# Altium schematic sheet PP1_PIC32.SchDoc
size 250 x 199 mm
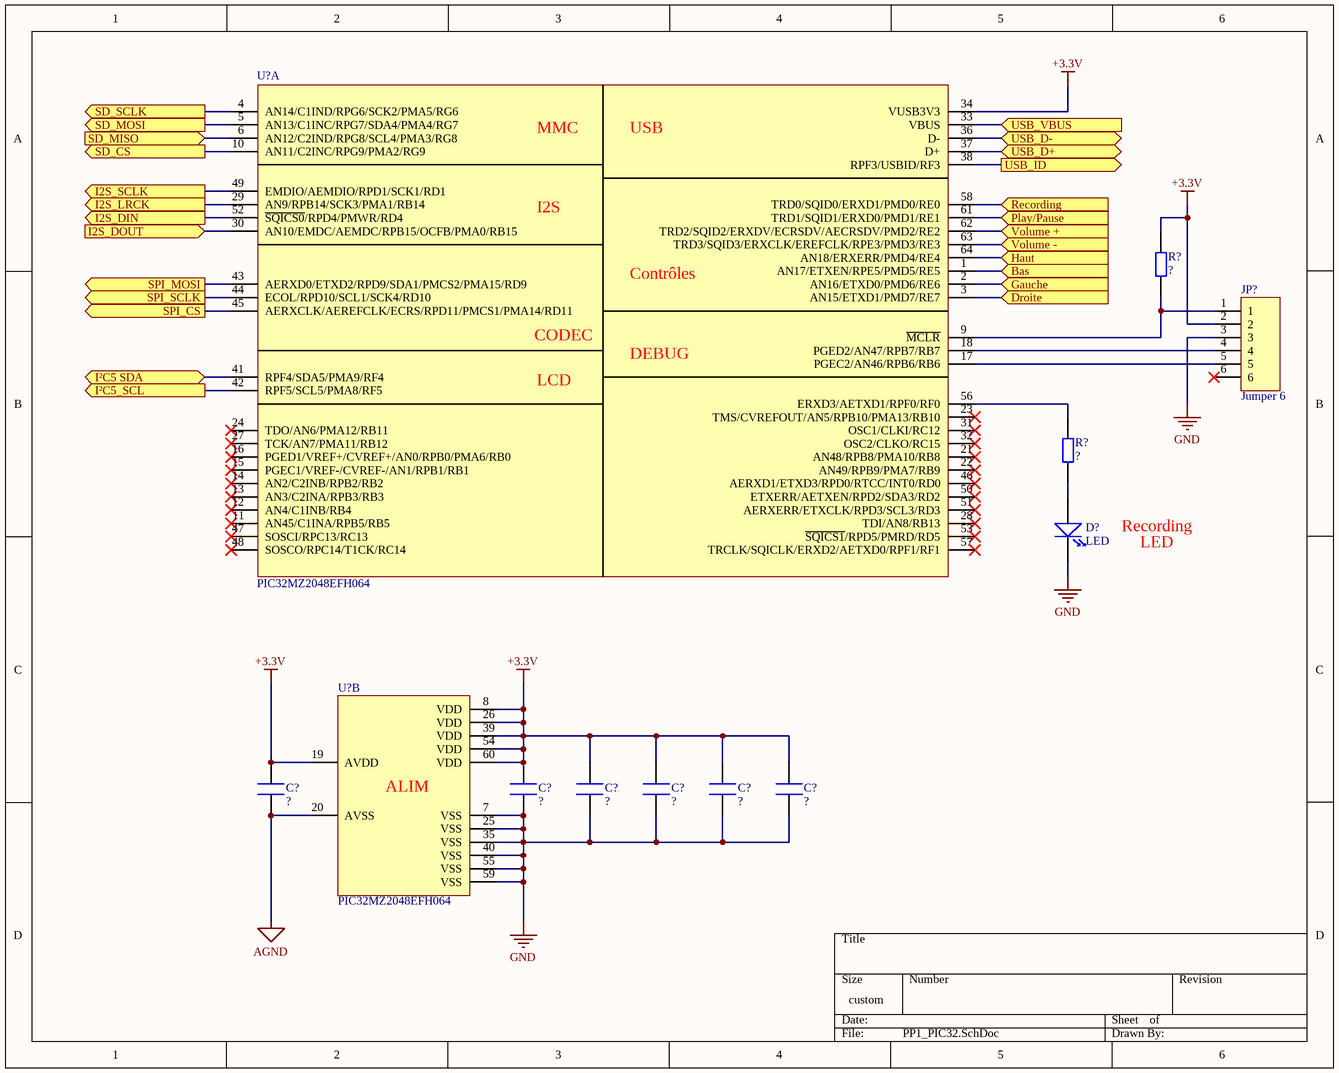
[diagram p0: PP1_PIC32.SchDoc]

## Parts
(Parts that share a designator on the sheet are numbered #1, #2 ... from top to bottom, then left to right.)
C?#1  Condo  (value not drawn)  (no BOM)
C?#2  Condo  (value not drawn)  (no BOM)
C?#3  Condo  (value not drawn)  (no BOM)
C?#4  Condo  (value not drawn)  (no BOM)
C?#5  Condo  (value not drawn)  (no BOM)
C?#6  Condo  (value not drawn)  (no BOM)
D?  LED  (no BOM)
JP?  Jumper 6  (no BOM)
R?#1  Res  (value not drawn)  (no BOM)
R?#2  Res  (value not drawn)  (no BOM)
U?#1  PIC32MZ2048EFH064  (part A of 2)
U?#2  PIC32MZ2048EFH064  (part B of 2)

## Ports
Bas (in), Droite (in), Gauche (in), Haut (in), I2S_DIN (out), I2S_DOUT (in), I2S_LRCK (out), I2S_SCLK (out), I²C5 SDA (bidir), I²C5_SCL (out), Play/Pause (in), Recording (in), SD_CS (out), SD_MISO (in), SD_MOSI (out), SD_SCLK (out), SPI_CS (out), SPI_MOSI (out), SPI_SCLK (out), USB_D+ (bidir), USB_D- (bidir), USB_ID (out), USB_VBUS (in), Volume + (in), Volume - (in)

## Nets
+3.3V: C?#1.2 C?#2.2 C?#3.2 C?#4.2 C?#5.2 C?#6.2 JP?.2 R?#1.1 U?#1.34(VUSB3V3) U?#2.8(VDD) U?#2.19(AVDD) U?#2.26(VDD) U?#2.39(VDD) U?#2.54(VDD) U?#2.60(VDD)
AGND: C?#1.1 U?#2.20(AVSS)
GND: C?#2.1 C?#3.1 C?#4.1 C?#5.1 C?#6.1 D?.2(-) JP?.3 U?#2.7(VSS) U?#2.25(VSS) U?#2.35(VSS) U?#2.40(VSS) U?#2.55(VSS) U?#2.59(VSS)
Bas: U?#1.1(AN17/ETXEN/RPE5/PMD5/RE5) ; port Bas
Droite: U?#1.3(AN15/ETXD1/PMD7/RE7) ; port Droite
Gauche: U?#1.2(AN16/ETXD0/PMD6/RE6) ; port Gauche
Haut: U?#1.64(AN18/ERXERR/PMD4/RE4) ; port Haut
I2S_DIN: U?#1.52(~{SQICS0}/RPD4/PMWR/RD4) ; port I2S_DIN
I2S_DOUT: U?#1.30(AN10/EMDC/AEMDC/RPB15/OCFB/PMA0/RB15) ; port I2S_DOUT
I2S_LRCK: U?#1.29(AN9/RPB14/SCK3/PMA1/RB14) ; port I2S_LRCK
I2S_SCLK: U?#1.49(EMDIO/AEMDIO/RPD1/SCK1/RD1) ; port I2S_SCLK
I²C5 SDA: U?#1.41(RPF4/SDA5/PMA9/RF4) ; port I²C5 SDA
I²C5_SCL: U?#1.42(RPF5/SCL5/PMA8/RF5) ; port I²C5_SCL
Play/Pause: U?#1.61(TRD1/SQID1/ERXD0/PMD1/RE1) ; port Play/Pause
Recording: U?#1.58(TRD0/SQID0/ERXD1/PMD0/RE0) ; port Recording
SD_CS: U?#1.10(AN11/C2INC/RPG9/PMA2/RG9) ; port SD_CS
SD_MISO: U?#1.6(AN12/C2IND/RPG8/SCL4/PMA3/RG8) ; port SD_MISO
SD_MOSI: U?#1.5(AN13/C1INC/RPG7/SDA4/PMA4/RG7) ; port SD_MOSI
SD_SCLK: U?#1.4(AN14/C1IND/RPG6/SCK2/PMA5/RG6) ; port SD_SCLK
SPI_CS: U?#1.45(AERXCLK/AEREFCLK/ECRS/RPD11/PMCS1/PMA14/RD11) ; port SPI_CS
SPI_MOSI: U?#1.43(AERXD0/ETXD2/RPD9/SDA1/PMCS2/PMA15/RD9) ; port SPI_MOSI
SPI_SCLK: U?#1.44(ECOL/RPD10/SCL1/SCK4/RD10) ; port SPI_SCLK
USB_D+: U?#1.37(D+) ; port USB_D+
USB_D-: U?#1.36(D-) ; port USB_D-
USB_ID: U?#1.38(RPF3/USBID/RF3) ; port USB_ID
USB_VBUS: U?#1.33(VBUS) ; port USB_VBUS
Volume +: U?#1.62(TRD2/SQID2/ERXDV/ECRSDV/AECRSDV/PMD2/RE2) ; port Volume +
Volume -: U?#1.63(TRD3/SQID3/ERXCLK/EREFCLK/RPE3/PMD3/RE3) ; port Volume -
NetD?_1: D?.1(+) R?#2.1
NetJP?_1: JP?.1 R?#1.2 U?#1.9(~{MCLR})
NetJP?_4: JP?.4 U?#1.18(PGED2/AN47/RPB7/RB7)
NetJP?_5: JP?.5 U?#1.17(PGEC2/AN46/RPB6/RB6)
NetR?#2_2: R?#2.2 U?#1.56(ERXD3/AETXD1/RPF0/RF0)

Not connected (* = marked no-connect by the designer): JP? 6*; U?#1 11(AN45/C1INA/RPB5/RB5)* 12(AN4/C1INB/RB4)* 13(AN3/C2INA/RPB3/RB3)* 14(AN2/C2INB/RPB2/RB2)* 15(PGEC1/VREF-/CVREF-/AN1/RPB1/RB1)* 16(PGED1/VREF+/CVREF+/AN0/RPB0/PMA6/RB0)* 21(AN48/RPB8/PMA10/RB8)* 22(AN49/RPB9/PMA7/RB9)* 23(TMS/CVREFOUT/AN5/RPB10/PMA13/RB10)* 24(TDO/AN6/PMA12/RB11)* 27(TCK/AN7/PMA11/RB12)* 28(TDI/AN8/RB13)* 31(OSC1/CLKI/RC12)* 32(OSC2/CLKO/RC15)* 46(AERXD1/ETXD3/RPD0/RTCC/INT0/RD0)* 47(SOSCI/RPC13/RC13)* 48(SOSCO/RPC14/T1CK/RC14)* 50(ETXERR/AETXEN/RPD2/SDA3/RD2)* 51(AERXERR/ETXCLK/RPD3/SCL3/RD3)* 53(~{SQICS1}/RPD5/PMRD/RD5)* 57(TRCLK/SQICLK/ERXD2/AETXD0/RPF1/RF1)*

## Notes on the sheet
- Recording
- LED
- (in symbol PIC32MZ, part A) MMC; USB; I2S; Contrôles; CODEC; DEBUG; LCD
- (in symbol PIC32MZ, part B) ALIM

## Library data of the parts
C?#1-C?#6 = Condo: Condensateur; Valeur: ?
D? = LED: LED Standard
JP? = Jumper 6: Jumper 6 Pins Mâle-Femelle
R?#1 R?#2 = Res: Résistance; Valeur: ?
U?#1 U?#2 = PIC32MZ: Micro-contrôleur PIC32MZ; Fabricant: Microchip; RefFabricant: PIC32MZ2048EFH064; DataSheet: http://ww1.microchip.com/downloads/en/DeviceDoc/60001320D.pdf